# Altium schematic sheet Motor.SchDoc
size A4
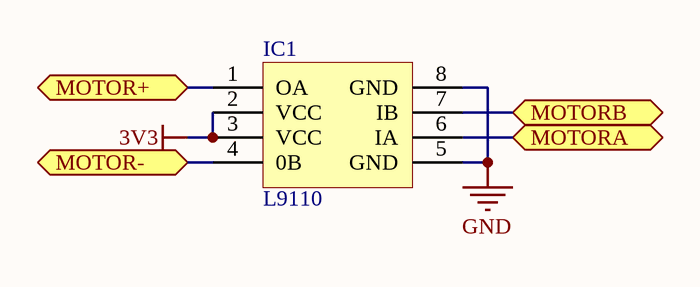
[diagram p0: Motor.SchDoc]

## Parts
IC1  L9110  [SOP8_N]

## Ports
MOTOR+ (bidir), MOTOR- (bidir), MOTORA (bidir), MOTORB (bidir)

## Nets
3V3: IC1.2(VCC) IC1.3(VCC)
GND: IC1.5(GND) IC1.8(GND)
MOTOR+: IC1.1(OA) ; port MOTOR+
MOTOR-: IC1.4(0B) ; port MOTOR-
MOTORA: IC1.6(IA) ; port MOTORA
MOTORB: IC1.7(IB) ; port MOTORB

## Library data of the parts
IC1 = L9110: 直流电机控制芯片; 版权归属: 封装库来自淘宝 ID：黄晶宝石; BOM名称: 直流电机控制芯片; 学习资源: https://shop463601444.taobao.com